# EAGLE schematic Schematic (EAGLE 9.6.2)
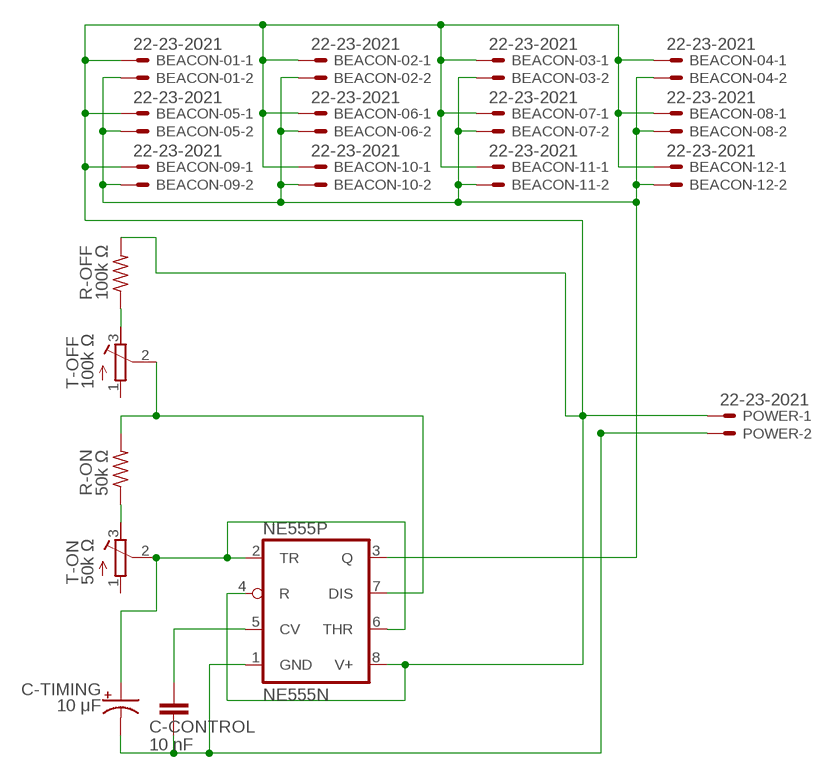
[diagram p0: schematic, sheet 1]

## Parts
BEACON-01  22-23-2021  [22-23-2021]
BEACON-02  22-23-2021  [22-23-2021]
BEACON-03  22-23-2021  [22-23-2021]
BEACON-04  22-23-2021  [22-23-2021]
BEACON-05  22-23-2021  [22-23-2021]
BEACON-06  22-23-2021  [22-23-2021]
BEACON-07  22-23-2021  [22-23-2021]
BEACON-08  22-23-2021  [22-23-2021]
BEACON-09  22-23-2021  [22-23-2021]
BEACON-10  22-23-2021  [22-23-2021]
BEACON-11  22-23-2021  [22-23-2021]
BEACON-12  22-23-2021  [22-23-2021]
C-CONTROL  10 nF  C2.5/2  [C2.5-2]
C-TIMING  10 μF  CPOL-USE2-5  [E2-5]
NE555P  NE555N  [DIL08]
POWER  22-23-2021  [22-23-2021]
R-OFF  100k Ω  R-US_0207/7  [0207/7]
R-ON  50k Ω  R-US_0207/7  [0207/7]
T-OFF  100k Ω  R-TRIMM5X  [RTRIM5X]
T-ON  50k Ω  R-TRIMM5X  [RTRIM5X]

## Nets
N$1: C-CONTROL.1 NE555P.5(CV)
N$2: R-ON.1 T-ON.3(E)
N$3: NE555P.7(DIS) R-ON.2 T-OFF.2(S)
N$4: BEACON-01.1 BEACON-02.1 BEACON-03.1 BEACON-04.1 BEACON-05.1 BEACON-06.1 BEACON-07.1 BEACON-08.1 BEACON-09.1 BEACON-10.1 BEACON-11.1 BEACON-12.1 NE555P.4(R) NE555P.8(V+) POWER.1 R-OFF.2
N$5: R-OFF.1 T-OFF.3(E)
N$7: BEACON-01.2 BEACON-02.2 BEACON-03.2 BEACON-04.2 BEACON-05.2 BEACON-06.2 BEACON-07.2 BEACON-08.2 BEACON-09.2 BEACON-10.2 BEACON-11.2 BEACON-12.2 NE555P.3(Q)
N$8: C-TIMING.+ NE555P.2(TR) NE555P.6(THR) T-ON.2(S)
N$11: C-CONTROL.2 C-TIMING.- NE555P.1(GND) POWER.2
Unconnected: T-OFF.1(A) T-ON.1(A)

## Library data of the parts
BEACON-01-BEACON-09 BEACON-10-BEACON-12 POWER = con-molex:22-23-2021: .100" (2.54mm) Center Header - 2 Pin; MF: MOLEX; MPN: 22-23-2021; OC_FARNELL: 1462926; OC_NEWARK: 25C3832
C-CONTROL = capacitor-wima:C: CAPACITOR naming: grid - package width
C-TIMING = rcl:CPOL-US: POLARIZED CAPACITOR, American symbol; SPICEPREFIX: C
NE555P = linear:*555: TIMER
R-OFF R-ON = rcl:R-US_: RESISTOR, American symbol; SPICEPREFIX: R
T-OFF T-ON = rcl:R-TRIMM: Trimm resistor; SPICEMODEL: X; SPICEPREFIXL: POT